# EAGLE design untitled (EAGLE 7.2.0)
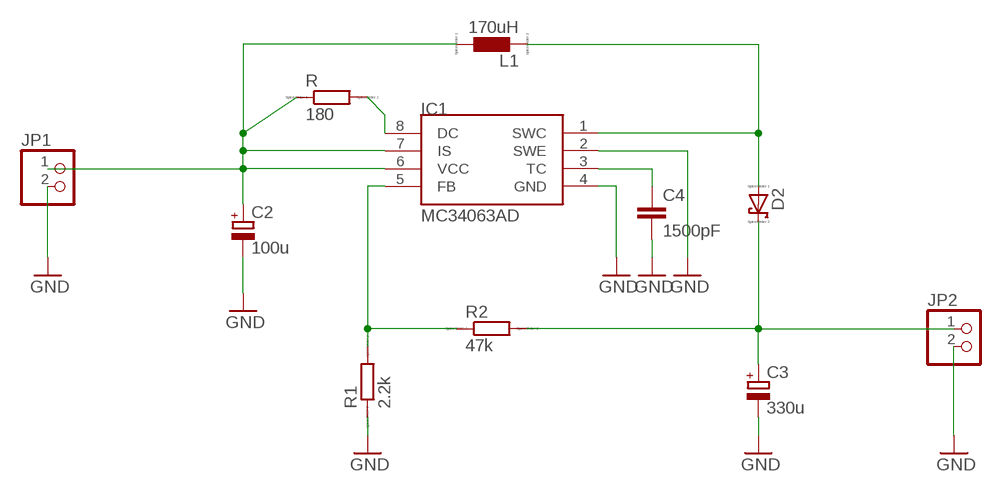
[diagram p0: schematic, sheet 1]

## Parts
C2  100u  CPOL-EUE1.8-4  [E1,8-4]
C3  330u  CPOL-EUE1.8-4  [E1,8-4]
C4  1500pF  C2,5-3  [C2.5-3]
D2  SCHOTTKY-DIODEDO35-7  [DIODE_DO35-7]
IC1  MC34063AD  [SOIC8]
JP1  PINHD-1X2  [1X02]
JP2  PINHD-1X2  [1X02]
L1  170uH  L0204/7  [0204/7]
R  180  R0204/7  [0204/7]
R1  2.2k  R0204/7  [0204/7]
R2  47k  R0204/7  [0204/7]

## Nets
GND: C2.- C3.- C4.2 IC1.2(SWE) IC1.4(GND) JP1.2 JP2.2 R1.1
N$1: C2.+ IC1.6(VCC) IC1.7(IS) JP1.1 L1.1 R.1
N$2: IC1.8(DC) R.2
N$3: IC1.5(FB) R1.2 R2.1
N$5: C3.+ D2.C(A) JP2.1 R2.2
N$6: D2.A(C) IC1.1(SWC) L1.2
N$7: C4.1 IC1.3(TC)

## Library data of the parts
C2 C3 = rcl:CPOL-EU: POLARIZED CAPACITOR, European symbol
C4 = capacitor-wima:C: CAPACITOR naming: grid - package width
D2 = eagle-ltspice:SCHOTTKY-DIODE: Schottky Diode; SPICEMODEL: NONE; SPICEPREFIX: D; SPICETYPE: diode
IC1 = mc34063:MC34063
JP1 JP2 = pinhead:PINHD-1X2: PIN HEADER
L1 = eagle-ltspice:L: INDUCTOR, European symbol; SPICEMODEL: NONE; SPICEPREFIX: L
R R1 R2 = eagle-ltspice:R: RESISTOR, European symbol; SPICEMODEL: NONE; SPICEPREFIX: R

## Board
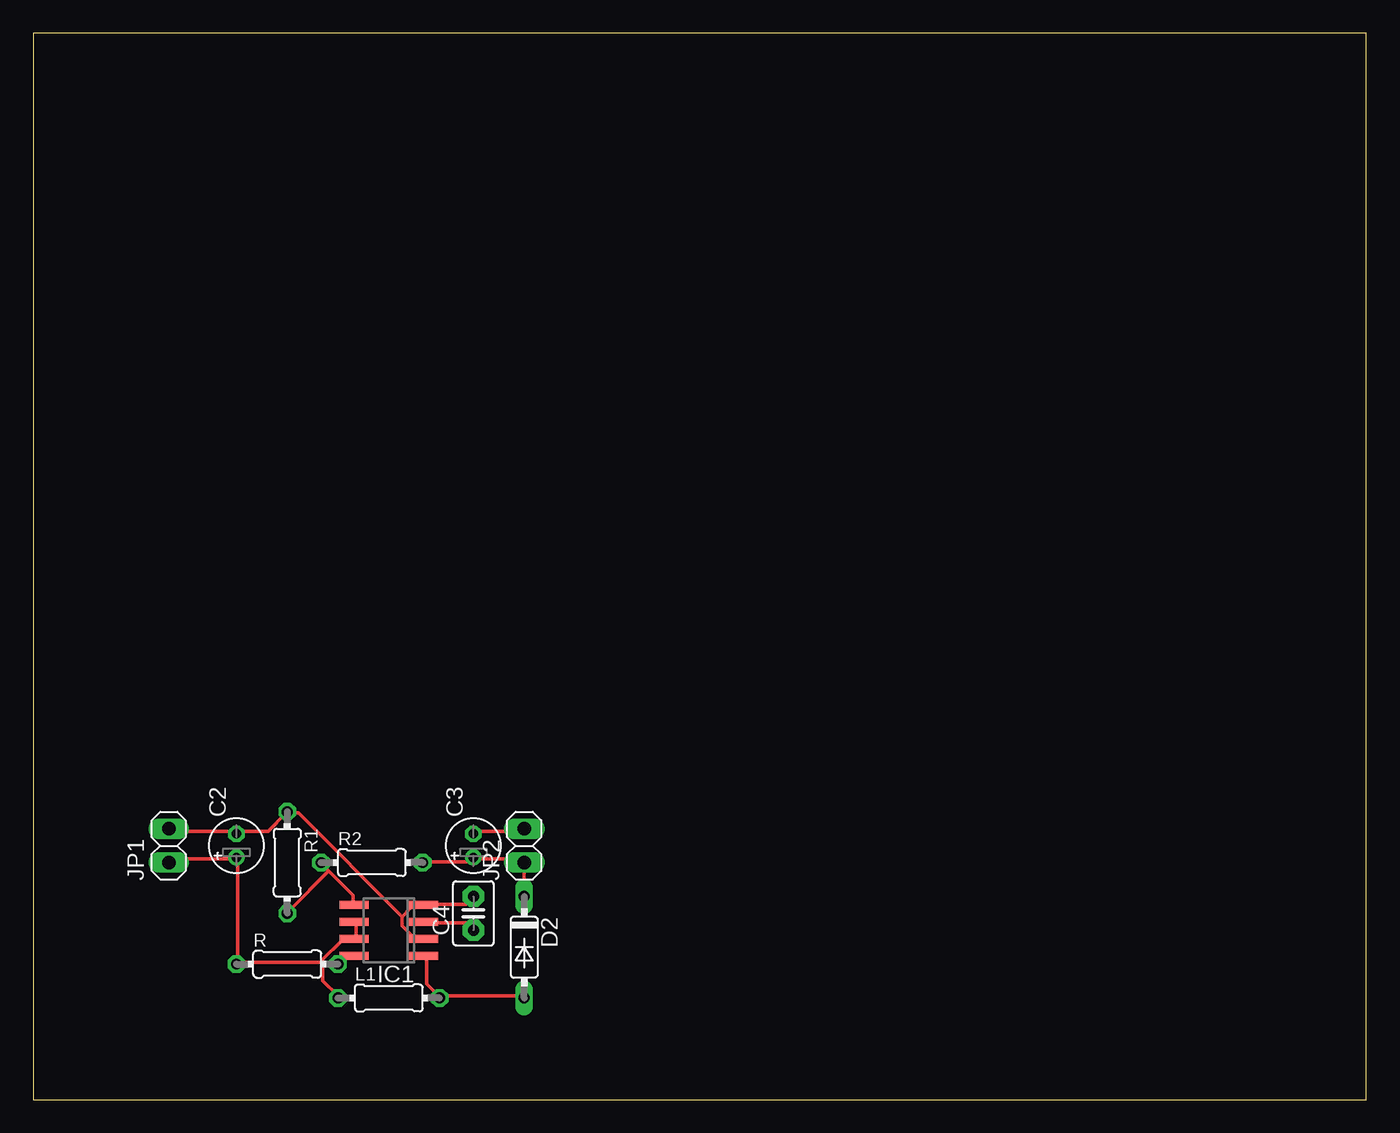
[diagram p1: board, top side]
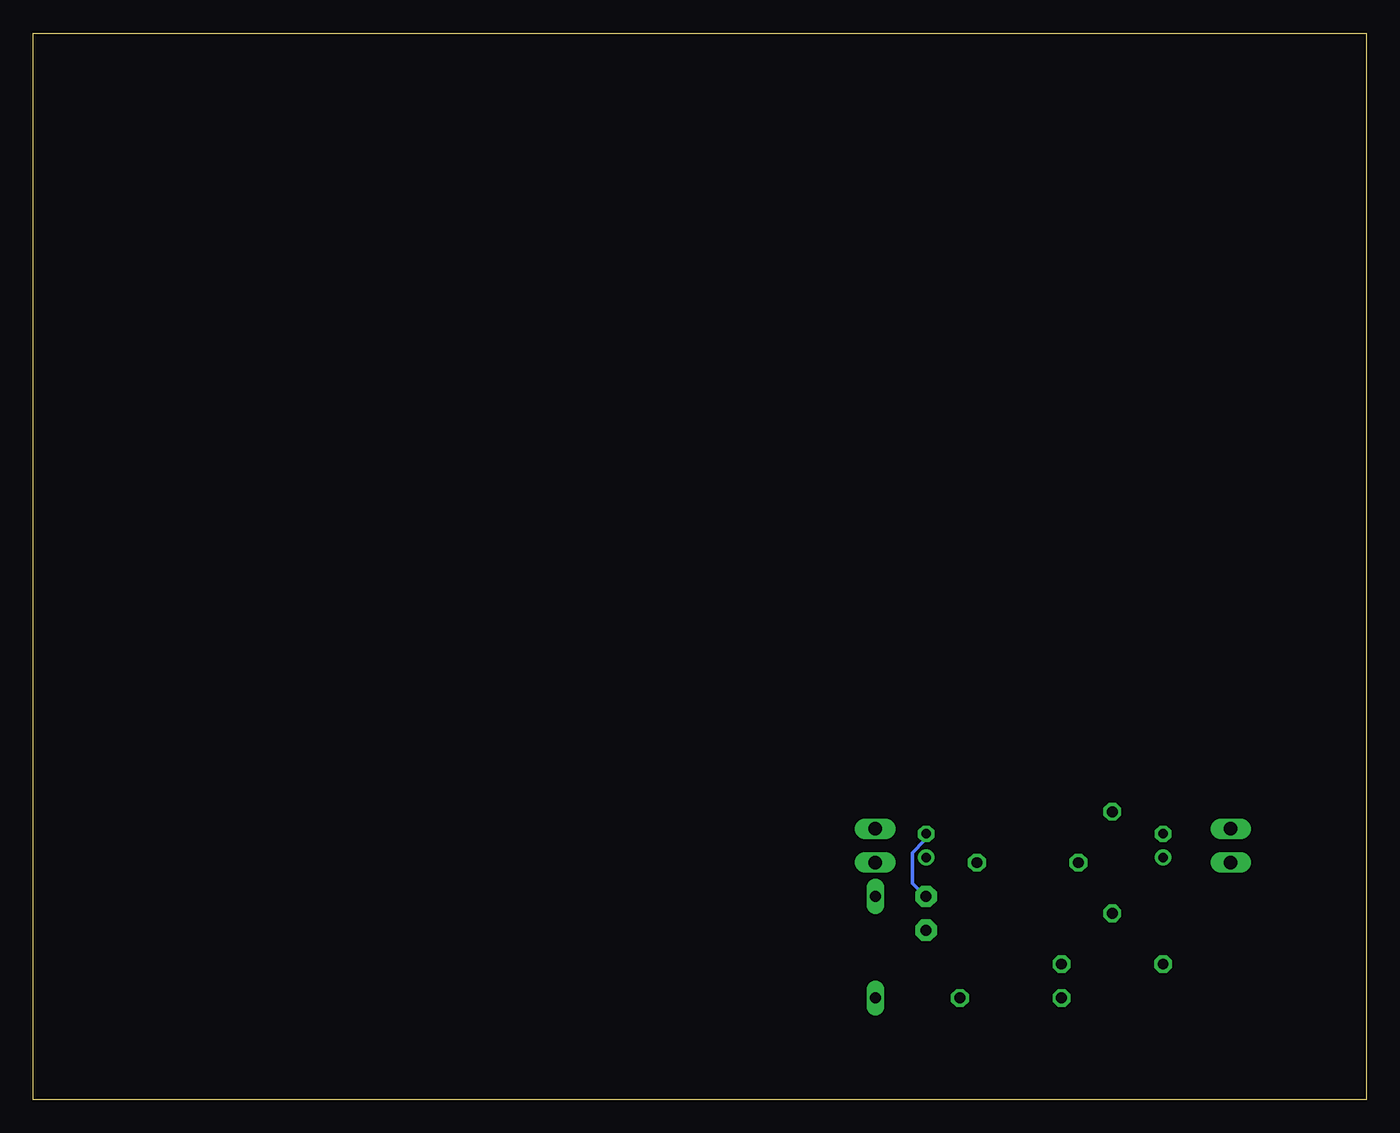
[diagram p2: board, bottom side, seen from below]

Size 100 x 80 mm. Coordinates in mm from the lower left corner, seen from the top.
Outline: 0,0 100,0 100,80 0,80 0,0
Copper layers (1*16): Top 0.035mm / dielectric 1.5mm / Bottom 0.035mm
Design rules "default": minimum track width 10mil, minimum drill 24mil, track to track 8mil, track to pad 8mil, pad to pad 8mil, via to via 8mil, smd to smd 8mil, copper to edge 40mil, drill to drill 8mil, minimum pad ring 10mil, minimum via ring 8mil, stop-mask expansion 4mil, vias tented up to drill 0mil, thermal gap 10mil

### Footprints (pad centres in the part's own frame; a part is rotated, then mirrored left to right if it is on the bottom)
E1,8-4 = drill 0.711 pad 1.168: + -0.889,0 | drill 0.711 pad 1.168 octagon: - 0.889,0
C2.5-3 = drill 0.813 pad 1.6 octagon: 1 -1.27,0; 2 1.27,0
DIODE_DO35-7 = drill 0.813 long: A 3.81,0; C -3.81,0
SOIC8 = smd 0.6 x 2.2: 1 -1.905,-2.6; 2 -0.635,-2.6; 3 0.635,-2.6; 4 1.905,-2.6; 5 1.905,2.6; 6 0.635,2.6; 7 -0.635,2.6; 8 -1.905,2.6
1X02 = drill 1.016 long: 1 -1.27,0; 2 1.27,0
0204/7 = drill 0.813 octagon: 1 -3.81,0; 2 3.81,0

### Placement (x,y rotation side)
C2  15.24,19.05 90 top
C3  33.02,19.05 90 top
C4  33.02,13.97 90 top
D2  36.83,11.43 270 top
IC1  26.67,12.7 90 top
JP1  10.16,19.05 90 top
JP2  36.83,19.05 90 top
L1  26.67,7.62 0 top
R  19.05,10.16 0 top
R1  19.05,17.78 270 top
R2  25.4,17.78 0 top

### Tracks (layer width: path | path; a pad name or v marks a point on that pad's centre or on a via)
GND
  Top 0.254: JP1.2 10.29,20.12 15.09,20.12 C2.- 15.32,20.12 17.6,20.12 18.97,21.49 R1.1 19.2,21.49 19.89,21.49 27.66,13.72 | C3.- 33.15,20.12 36.8,20.12 JP2.2 | 27.66,13.72 27.66,13.03 28.57,12.12 29.26,12.12 IC1.2 | 27.66,13.72 28.35,14.4 29.26,14.4 IC1.4 29.49,14.63 32.46,14.63 32.92,15.09 C4.2
  Bottom 0.254: C3.- 33.15,19.89 33.15,19.43 34.06,18.52 34.06,16.23 33.15,15.32 C4.2
N$1
  Top 0.254: JP1.1 10.29,17.83 10.52,18.06 15.09,18.06 C2.+ 15.32,18.06 15.32,10.29 | IC1.6 24.23,13.26 24.23,12.12 IC1.7 24,11.89 23.09,11.89 21.72,10.52 21.72,10.29 | 21.72,10.29 21.72,8.91 22.86,7.77 L1.1 | 21.72,10.29 15.32,10.29 | 15.32,10.29 R.1
N$2
  Top 0.254: IC1.8 24,10.74 23.32,10.74 22.86,10.29 R.2
N$3
  Top 0.254: 22.17,17.14 21.72,17.6 R2.1 | 22.17,17.14 24,15.32 24,14.63 IC1.5 | 22.17,17.14 19.2,14.17 R1.2
N$5
  Top 0.254: D2.C 36.8,15.32 36.8,17.6 JP2.1 36.8,17.83 36.58,18.06 33.15,18.06 C3.+ 32.69,17.83 29.26,17.83 R2.2
N$6
  Top 0.254: IC1.1 29.49,10.74 29.49,8.69 30.4,7.77 L1.2 30.63,7.77 36.8,7.77 D2.A
N$7
  Top 0.254: C4.1 32.46,13.26 29.49,13.26 IC1.3